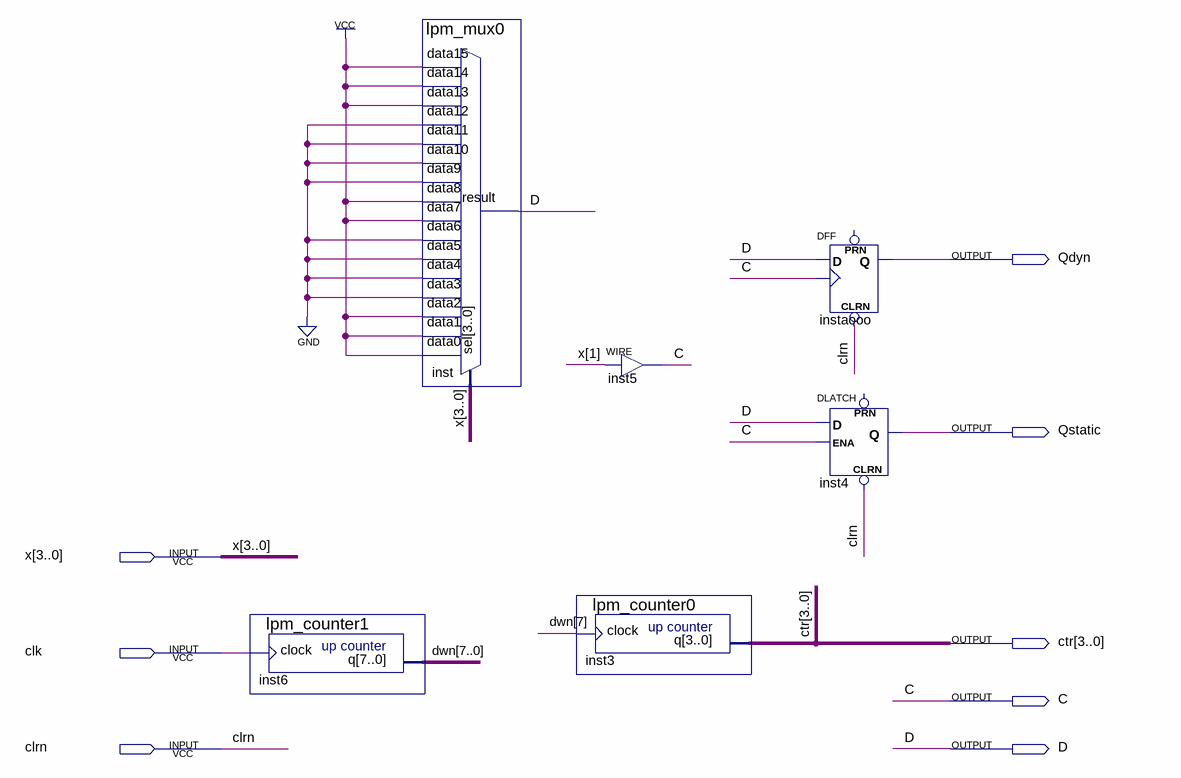
[diagram p0: schematic sheet]
// Quartus schematic lab4D.bdf as structural Verilog: 6 symbols, 8 pins
module lab4D (
  input  [3:0] x,
  input  clk,
  input  clrn,
  output Qdyn,
  output Qstatic,
  output [3:0] ctr,
  output C,
  output D
);

  wire [7:0] dwn;

  lpm_counter1 inst6 (.clock(clk), .q(dwn));
  lpm_mux0 inst (
    .data15(1'b1), .data14(1'b1), .data13(1'b1), .data12(1'b0), .data11(1'b0), .data10(1'b0), .data9(1'b0),
    .data8(1'b1), .data7(1'b1), .data6(1'b0), .data5(1'b0), .data4(1'b0), .data3(1'b0), .data2(1'b1),
    .data1(1'b1), .data0(1'b1), .sel(x), .result(D));
  assign C = x[1];  // WIRE inst5
  lpm_counter0 inst3 (.clock(dwn[7]), .q(ctr));
  DFF instaooo (.CLRN(clrn), .CLK(C), .D(D), .Q(Qdyn));  // open: PRN
  DLATCH inst4 (.CLRN(clrn), .D(D), .ENA(C), .Q(Qstatic));  // open: PRN
endmodule
